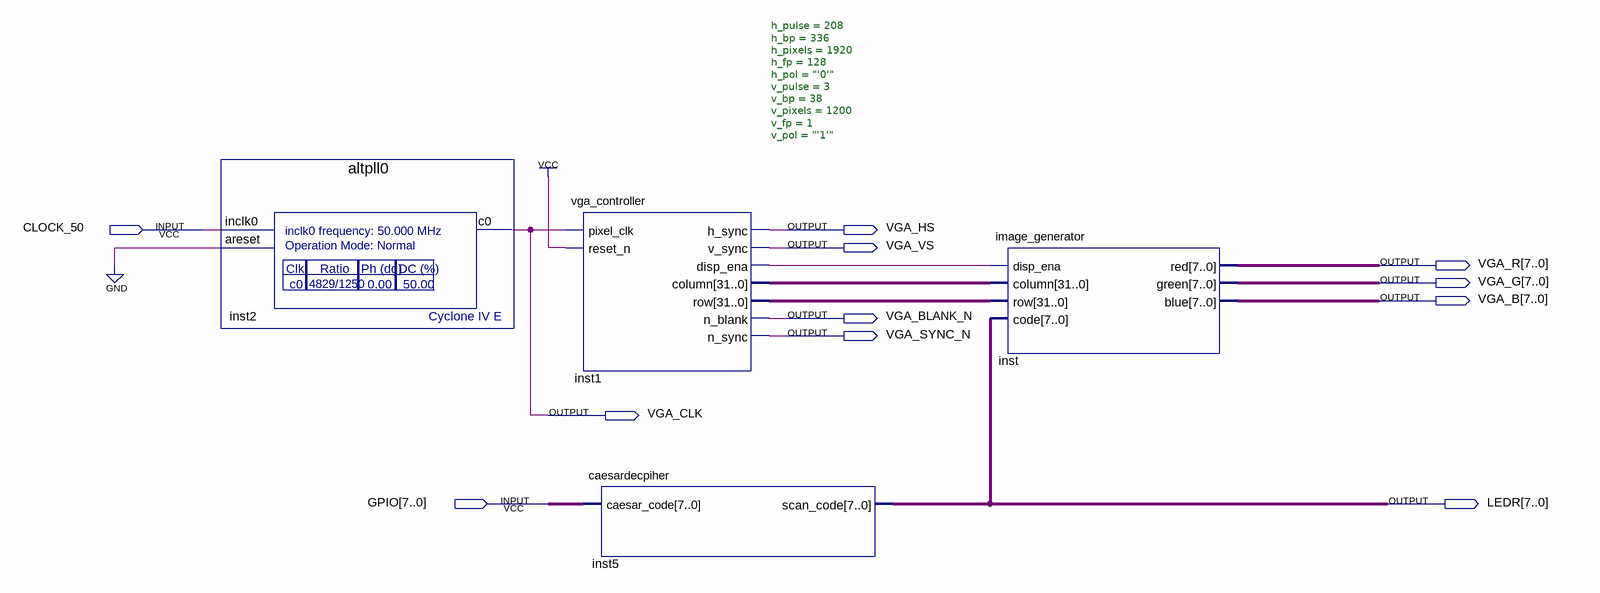
[diagram p0: schematic sheet]
// Quartus schematic plytka_vga.bdf as structural Verilog: 4 symbols, 11 pins
module plytka_vga (
  input  CLOCK_50,
  input  [7:0] GPIO,
  output VGA_HS,
  output VGA_VS,
  output [7:0] VGA_R,
  output [7:0] VGA_G,
  output [7:0] VGA_B,
  output VGA_BLANK_N,
  output VGA_SYNC_N,
  output VGA_CLK,
  output [7:0] LEDR
);

  wire inst1_disp_ena;
  wire [31:0] inst1_column, inst1_row;

  altpll0 inst2 (.inclk0(CLOCK_50), .areset(1'b0), .c0(VGA_CLK));
  vga_controller #(.h_pulse(208), .h_bp(336), .h_pixels(1920), .h_fp(128), .h_pol("'0'"), .v_pulse(3), .v_bp(38), .v_pixels(1200), .v_fp(1), .v_pol("'1'")) inst1 (
    .pixel_clk(VGA_CLK), .reset_n(1'b1), .h_sync(VGA_HS), .v_sync(VGA_VS), .disp_ena(inst1_disp_ena),
    .column(inst1_column), .row(inst1_row), .n_blank(VGA_BLANK_N), .n_sync(VGA_SYNC_N));
  caesardecpiher inst5 (.caesar_code(GPIO), .scan_code(LEDR));
  image_generator inst (
    .disp_ena(inst1_disp_ena), .column(inst1_column), .row(inst1_row), .code(LEDR), .red(VGA_R),
    .green(VGA_G), .blue(VGA_B));
endmodule
